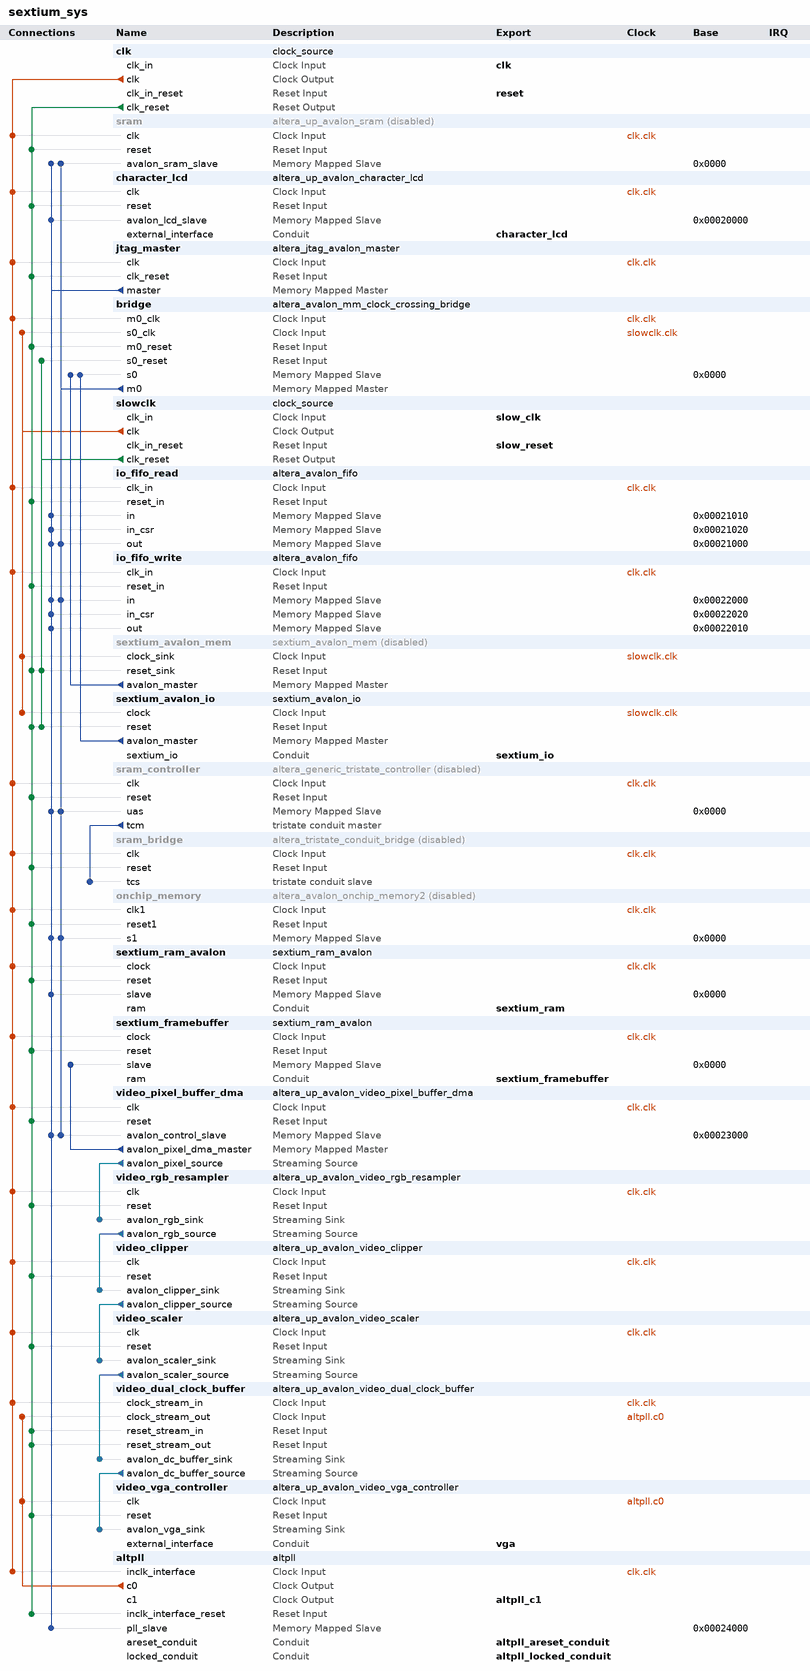
[diagram p0: system contents]
# Platform Designer (Qsys) system sextium_sys, Cyclone IV E EP4CE115F29C7
# Parameters at their usual value, and those the tool derives, are not listed.
package require -exact qsys 16.1
create_system sextium_sys
set_project_property DEVICE_FAMILY {Cyclone IV E}
set_project_property DEVICE EP4CE115F29C7

add_instance clk clock_source 16.1
set_instance_parameter_value clk clockFrequency 50000000

add_instance sram altera_up_avalon_sram 16.1
set_instance_property sram ENABLED false
set_instance_property sram AUTO_EXPORT true
set_instance_parameter_value sram board DE2-115
set_instance_parameter_value sram pixel_buffer false

add_instance character_lcd altera_up_avalon_character_lcd 16.1
set_instance_parameter_value character_lcd cursor None

add_instance jtag_master altera_jtag_avalon_master 16.1

add_instance bridge altera_avalon_mm_clock_crossing_bridge 16.1
set_instance_parameter_value bridge ADDRESS_WIDTH 32
set_instance_parameter_value bridge COMMAND_FIFO_DEPTH 4
set_instance_parameter_value bridge DATA_WIDTH 32
set_instance_parameter_value bridge MASTER_SYNC_DEPTH 2
set_instance_parameter_value bridge MAX_BURST_SIZE 1
set_instance_parameter_value bridge RESPONSE_FIFO_DEPTH 4
set_instance_parameter_value bridge SLAVE_SYNC_DEPTH 2
set_instance_parameter_value bridge USE_AUTO_ADDRESS_WIDTH 0

add_instance slowclk clock_source 16.1
set_instance_parameter_value slowclk clockFrequency 50000000

add_instance io_fifo_read altera_avalon_fifo 16.1
set_instance_parameter_value io_fifo_read avalonMMAvalonMMDataWidth 16
set_instance_parameter_value io_fifo_read bitsPerSymbol 16
set_instance_parameter_value io_fifo_read channelWidth 8
set_instance_parameter_value io_fifo_read errorWidth 8
set_instance_parameter_value io_fifo_read fifoDepth 32
set_instance_parameter_value io_fifo_read fifoInputInterfaceOptions AVALONMM_WRITE
set_instance_parameter_value io_fifo_read fifoOutputInterfaceOptions AVALONMM_READ
set_instance_parameter_value io_fifo_read singleClockMode true
set_instance_parameter_value io_fifo_read symbolsPerBeat 1
set_instance_parameter_value io_fifo_read useIRQ false
set_instance_parameter_value io_fifo_read usePacket true
set_instance_parameter_value io_fifo_read useReadControl false

add_instance io_fifo_write altera_avalon_fifo 16.1
set_instance_parameter_value io_fifo_write avalonMMAvalonMMDataWidth 16
set_instance_parameter_value io_fifo_write bitsPerSymbol 16
set_instance_parameter_value io_fifo_write channelWidth 8
set_instance_parameter_value io_fifo_write errorWidth 8
set_instance_parameter_value io_fifo_write fifoDepth 16
set_instance_parameter_value io_fifo_write fifoInputInterfaceOptions AVALONMM_WRITE
set_instance_parameter_value io_fifo_write fifoOutputInterfaceOptions AVALONMM_READ
set_instance_parameter_value io_fifo_write singleClockMode true
set_instance_parameter_value io_fifo_write symbolsPerBeat 2
set_instance_parameter_value io_fifo_write useIRQ false
set_instance_parameter_value io_fifo_write usePacket true
set_instance_parameter_value io_fifo_write useReadControl false

add_instance sextium_avalon_mem sextium_avalon_mem 1.1
set_instance_property sextium_avalon_mem ENABLED false

add_instance sextium_avalon_io sextium_avalon_io 1.1
set_instance_parameter_value sextium_avalon_io IO_ADDR_OFFSET 131072
set_instance_parameter_value sextium_avalon_io READ_FIFO_ADDR 135168
set_instance_parameter_value sextium_avalon_io WRITE_FIFO_ADDR 139264

add_instance sram_controller altera_generic_tristate_controller 16.1
set_instance_property sram_controller ENABLED false
set_instance_parameter_value sram_controller ACTIVE_LOW_BEGINTRANSFER 1
set_instance_parameter_value sram_controller ACTIVE_LOW_BYTEENABLE 1
set_instance_parameter_value sram_controller ACTIVE_LOW_OUTPUTENABLE 1
set_instance_parameter_value sram_controller ACTIVE_LOW_READ 0
set_instance_parameter_value sram_controller ACTIVE_LOW_RESET_OUTPUT 1
set_instance_parameter_value sram_controller CHIPSELECT_THROUGH_READLATENCY 1
set_instance_parameter_value sram_controller INTERFACE_ASSIGNMENT_KEYS embeddedsw.configuration.isMemoryDevice
set_instance_parameter_value sram_controller INTERFACE_ASSIGNMENT_VALUES 1
set_instance_parameter_value sram_controller MODULE_ASSIGNMENT_KEYS embeddedsw.configuration.hwClassnameDriverSupportList,embeddedsw.CMacro.SRAM_MEMORY_SIZE,embeddedsw.CMacro.SRAM_MEMORY_UNITS,embeddedsw.CMacro.SSRAM_DATA_WIDTH,embeddedsw.CMacro.SSRAM_READ_LATENCY,embeddedsw.memoryInfo.MEM_INIT_DATA_WIDTH,embeddedsw.memoryInfo.HAS_BYTE_LANE,embeddedsw.memoryInfo.GENERATE_DAT_SYM,embeddedsw.memoryInfo.DAT_SYM_INSTALL_DIR
set_instance_parameter_value sram_controller MODULE_ASSIGNMENT_VALUES altera_avalon_lan91c111:altera_avalon_cfi_flash,2,1048576,16,2,16,1,1,SIM_DIR
set_instance_parameter_value sram_controller TCM_ADDRESS_W 21
set_instance_parameter_value sram_controller TCM_BYTEENABLE_W 2
set_instance_parameter_value sram_controller TCM_DATA_HOLD 1
set_instance_parameter_value sram_controller TCM_DATA_W 16
set_instance_parameter_value sram_controller TCM_MAX_PENDING_READ_TRANSACTIONS 5
set_instance_parameter_value sram_controller TCM_READLATENCY 4
set_instance_parameter_value sram_controller TCM_READ_WAIT 1
set_instance_parameter_value sram_controller TCM_SETUP_WAIT 1
set_instance_parameter_value sram_controller TCM_SYMBOLS_PER_WORD 2
set_instance_parameter_value sram_controller TCM_TIMING_UNITS 1
set_instance_parameter_value sram_controller TCM_TURNAROUND_TIME 2
set_instance_parameter_value sram_controller TCM_WRITE_WAIT 1
set_instance_parameter_value sram_controller USE_BEGINTRANSFER 1
set_instance_parameter_value sram_controller USE_BYTEENABLE 1
set_instance_parameter_value sram_controller USE_OUTPUTENABLE 1
set_instance_parameter_value sram_controller USE_READ 0

add_instance sram_bridge altera_tristate_conduit_bridge 16.1
set_instance_property sram_bridge ENABLED false

add_instance onchip_memory altera_avalon_onchip_memory2 16.1
set_instance_property onchip_memory ENABLED false
set_instance_parameter_value onchip_memory dataWidth 16
set_instance_parameter_value onchip_memory dualPort false
set_instance_parameter_value onchip_memory initMemContent false
set_instance_parameter_value onchip_memory initializationFileName onchip_mem.hex
set_instance_parameter_value onchip_memory memorySize 131072

add_instance sextium_ram_avalon sextium_ram_avalon 1.0

add_instance sextium_framebuffer sextium_ram_avalon 1.0

add_instance video_pixel_buffer_dma altera_up_avalon_video_pixel_buffer_dma 16.1
set_instance_parameter_value video_pixel_buffer_dma addr_mode Consecutive
set_instance_parameter_value video_pixel_buffer_dma back_start_address 65536
set_instance_parameter_value video_pixel_buffer_dma color_space {8-bit RGB}
set_instance_parameter_value video_pixel_buffer_dma image_height 200
set_instance_parameter_value video_pixel_buffer_dma image_width 320
set_instance_parameter_value video_pixel_buffer_dma start_address 0

add_instance video_rgb_resampler altera_up_avalon_video_rgb_resampler 16.1
set_instance_parameter_value video_rgb_resampler alpha 1023
set_instance_parameter_value video_rgb_resampler input_type {8-bit RGB}
set_instance_parameter_value video_rgb_resampler output_type {30-bit RGB}

add_instance video_clipper altera_up_avalon_video_clipper 16.1
set_instance_parameter_value video_clipper add_bottom 20
set_instance_parameter_value video_clipper add_top 20
set_instance_parameter_value video_clipper color_bits 10
set_instance_parameter_value video_clipper color_planes 3
set_instance_parameter_value video_clipper drop_bottom 0
set_instance_parameter_value video_clipper drop_left 0
set_instance_parameter_value video_clipper drop_right 0
set_instance_parameter_value video_clipper drop_top 0
set_instance_parameter_value video_clipper height_in 200
set_instance_parameter_value video_clipper width_in 320

add_instance video_scaler altera_up_avalon_video_scaler 16.1
set_instance_parameter_value video_scaler color_bits 10
set_instance_parameter_value video_scaler color_planes 3
set_instance_parameter_value video_scaler height_scaling 2
set_instance_parameter_value video_scaler width_in 320
set_instance_parameter_value video_scaler width_scaling 2

add_instance video_dual_clock_buffer altera_up_avalon_video_dual_clock_buffer 16.1
set_instance_parameter_value video_dual_clock_buffer color_bits 10

add_instance video_vga_controller altera_up_avalon_video_vga_controller 16.1
set_instance_parameter_value video_vga_controller board DE2-115
set_instance_parameter_value video_vga_controller resolution {VGA 640x480}

add_instance altpll altpll 16.1
set_instance_parameter_value altpll CLK0_DIVIDE_BY 2
set_instance_parameter_value altpll CLK0_MULTIPLY_BY 1
set_instance_parameter_value altpll CLK1_DIVIDE_BY 1000
set_instance_parameter_value altpll CLK1_DUTY_CYCLE 50
set_instance_parameter_value altpll CLK1_MULTIPLY_BY 1
set_instance_parameter_value altpll CLK1_PHASE_SHIFT 0
set_instance_parameter_value altpll INCLK0_INPUT_FREQUENCY 20000
set_instance_parameter_value altpll PORT_ARESET PORT_USED
set_instance_parameter_value altpll PORT_LOCKED PORT_USED
set_instance_parameter_value altpll PORT_clk1 PORT_USED
set_instance_parameter_value altpll PORT_clk2 PORT_UNUSED
set_instance_parameter_value altpll PORT_clk3 PORT_UNUSED

# connections
add_connection altpll.c0 video_dual_clock_buffer.clock_stream_out clock
add_connection altpll.c0 video_vga_controller.clk clock
add_connection clk.clk altpll.inclk_interface clock
add_connection clk.clk bridge.m0_clk clock
add_connection clk.clk character_lcd.clk clock
add_connection clk.clk io_fifo_read.clk_in clock
add_connection clk.clk io_fifo_write.clk_in clock
add_connection clk.clk jtag_master.clk clock
add_connection clk.clk onchip_memory.clk1 clock
add_connection clk.clk sextium_framebuffer.clock clock
add_connection clk.clk sextium_ram_avalon.clock clock
add_connection clk.clk sram.clk clock
add_connection clk.clk sram_bridge.clk clock
add_connection clk.clk sram_controller.clk clock
add_connection clk.clk video_clipper.clk clock
add_connection clk.clk video_dual_clock_buffer.clock_stream_in clock
add_connection clk.clk video_pixel_buffer_dma.clk clock
add_connection clk.clk video_rgb_resampler.clk clock
add_connection clk.clk video_scaler.clk clock
add_connection slowclk.clk bridge.s0_clk clock
add_connection slowclk.clk sextium_avalon_io.clock clock
add_connection slowclk.clk sextium_avalon_mem.clock_sink clock
add_connection clk.clk_reset altpll.inclk_interface_reset reset
add_connection clk.clk_reset bridge.m0_reset reset
add_connection clk.clk_reset character_lcd.reset reset
add_connection clk.clk_reset io_fifo_read.reset_in reset
add_connection clk.clk_reset io_fifo_write.reset_in reset
add_connection clk.clk_reset jtag_master.clk_reset reset
add_connection clk.clk_reset onchip_memory.reset1 reset
add_connection clk.clk_reset sextium_avalon_io.reset reset
add_connection clk.clk_reset sextium_avalon_mem.reset_sink reset
add_connection clk.clk_reset sextium_framebuffer.reset reset
add_connection clk.clk_reset sextium_ram_avalon.reset reset
add_connection clk.clk_reset sram.reset reset
add_connection clk.clk_reset sram_bridge.reset reset
add_connection clk.clk_reset sram_controller.reset reset
add_connection clk.clk_reset video_clipper.reset reset
add_connection clk.clk_reset video_dual_clock_buffer.reset_stream_in reset
add_connection clk.clk_reset video_dual_clock_buffer.reset_stream_out reset
add_connection clk.clk_reset video_pixel_buffer_dma.reset reset
add_connection clk.clk_reset video_rgb_resampler.reset reset
add_connection clk.clk_reset video_scaler.reset reset
add_connection clk.clk_reset video_vga_controller.reset reset
add_connection slowclk.clk_reset bridge.s0_reset reset
add_connection slowclk.clk_reset sextium_avalon_io.reset reset
add_connection slowclk.clk_reset sextium_avalon_mem.reset_sink reset
add_connection bridge.m0 io_fifo_read.out avalon
set_connection_parameter_value bridge.m0/io_fifo_read.out baseAddress 0x00021000
add_connection bridge.m0 io_fifo_write.in avalon
set_connection_parameter_value bridge.m0/io_fifo_write.in baseAddress 0x00022000
add_connection bridge.m0 onchip_memory.s1 avalon
set_connection_parameter_value bridge.m0/onchip_memory.s1 baseAddress 0x0000
add_connection bridge.m0 sram.avalon_sram_slave avalon
set_connection_parameter_value bridge.m0/sram.avalon_sram_slave baseAddress 0x0000
add_connection bridge.m0 sram_controller.uas avalon
set_connection_parameter_value bridge.m0/sram_controller.uas baseAddress 0x0000
add_connection bridge.m0 video_pixel_buffer_dma.avalon_control_slave avalon
set_connection_parameter_value bridge.m0/video_pixel_buffer_dma.avalon_control_slave baseAddress 0x00023000
add_connection jtag_master.master altpll.pll_slave avalon
set_connection_parameter_value jtag_master.master/altpll.pll_slave baseAddress 0x00024000
add_connection jtag_master.master character_lcd.avalon_lcd_slave avalon
set_connection_parameter_value jtag_master.master/character_lcd.avalon_lcd_slave baseAddress 0x00020000
add_connection jtag_master.master io_fifo_read.in avalon
set_connection_parameter_value jtag_master.master/io_fifo_read.in baseAddress 0x00021010
add_connection jtag_master.master io_fifo_read.in_csr avalon
set_connection_parameter_value jtag_master.master/io_fifo_read.in_csr baseAddress 0x00021020
add_connection jtag_master.master io_fifo_read.out avalon
set_connection_parameter_value jtag_master.master/io_fifo_read.out baseAddress 0x00021000
add_connection jtag_master.master io_fifo_write.in avalon
set_connection_parameter_value jtag_master.master/io_fifo_write.in baseAddress 0x00022000
add_connection jtag_master.master io_fifo_write.in_csr avalon
set_connection_parameter_value jtag_master.master/io_fifo_write.in_csr baseAddress 0x00022020
add_connection jtag_master.master io_fifo_write.out avalon
set_connection_parameter_value jtag_master.master/io_fifo_write.out baseAddress 0x00022010
add_connection jtag_master.master onchip_memory.s1 avalon
set_connection_parameter_value jtag_master.master/onchip_memory.s1 baseAddress 0x0000
add_connection jtag_master.master sextium_ram_avalon.slave avalon
set_connection_parameter_value jtag_master.master/sextium_ram_avalon.slave baseAddress 0x0000
add_connection jtag_master.master sram.avalon_sram_slave avalon
set_connection_parameter_value jtag_master.master/sram.avalon_sram_slave baseAddress 0x0000
add_connection jtag_master.master sram_controller.uas avalon
set_connection_parameter_value jtag_master.master/sram_controller.uas baseAddress 0x0000
add_connection jtag_master.master video_pixel_buffer_dma.avalon_control_slave avalon
set_connection_parameter_value jtag_master.master/video_pixel_buffer_dma.avalon_control_slave baseAddress 0x00023000
add_connection sextium_avalon_io.avalon_master bridge.s0 avalon
set_connection_parameter_value sextium_avalon_io.avalon_master/bridge.s0 baseAddress 0x0000
add_connection sextium_avalon_mem.avalon_master bridge.s0 avalon
set_connection_parameter_value sextium_avalon_mem.avalon_master/bridge.s0 baseAddress 0x0000
add_connection video_pixel_buffer_dma.avalon_pixel_dma_master sextium_framebuffer.slave avalon
set_connection_parameter_value video_pixel_buffer_dma.avalon_pixel_dma_master/sextium_framebuffer.slave baseAddress 0x0000
add_connection video_clipper.avalon_clipper_source video_scaler.avalon_scaler_sink avalon_streaming
add_connection video_dual_clock_buffer.avalon_dc_buffer_source video_vga_controller.avalon_vga_sink avalon_streaming
add_connection video_pixel_buffer_dma.avalon_pixel_source video_rgb_resampler.avalon_rgb_sink avalon_streaming
add_connection video_rgb_resampler.avalon_rgb_source video_clipper.avalon_clipper_sink avalon_streaming
add_connection video_scaler.avalon_scaler_source video_dual_clock_buffer.avalon_dc_buffer_sink avalon_streaming
add_connection sram_controller.tcm sram_bridge.tcs tristate_conduit

# exported interfaces
add_interface altpll_areset_conduit conduit end
set_interface_property altpll_areset_conduit EXPORT_OF altpll.areset_conduit
add_interface altpll_c1 clock source
set_interface_property altpll_c1 EXPORT_OF altpll.c1
add_interface altpll_locked_conduit conduit end
set_interface_property altpll_locked_conduit EXPORT_OF altpll.locked_conduit
add_interface character_lcd conduit end
set_interface_property character_lcd EXPORT_OF character_lcd.external_interface
add_interface clk clock sink
set_interface_property clk EXPORT_OF clk.clk_in
add_interface reset reset sink
set_interface_property reset EXPORT_OF clk.clk_in_reset
add_interface sextium_framebuffer conduit end
set_interface_property sextium_framebuffer EXPORT_OF sextium_framebuffer.ram
add_interface sextium_io conduit end
set_interface_property sextium_io EXPORT_OF sextium_avalon_io.sextium_io
add_interface sextium_ram conduit end
set_interface_property sextium_ram EXPORT_OF sextium_ram_avalon.ram
add_interface slow_clk clock sink
set_interface_property slow_clk EXPORT_OF slowclk.clk_in
add_interface slow_reset reset sink
set_interface_property slow_reset EXPORT_OF slowclk.clk_in_reset
add_interface vga conduit end
set_interface_property vga EXPORT_OF video_vga_controller.external_interface

set_interconnect_requirement {$system} qsys_mm.clockCrossingAdapter HANDSHAKE
set_interconnect_requirement {$system} qsys_mm.enableEccProtection FALSE
set_interconnect_requirement {$system} qsys_mm.insertDefaultSlave FALSE
set_interconnect_requirement {$system} qsys_mm.maxAdditionalLatency 1

save_system sextium_sys.qsys
